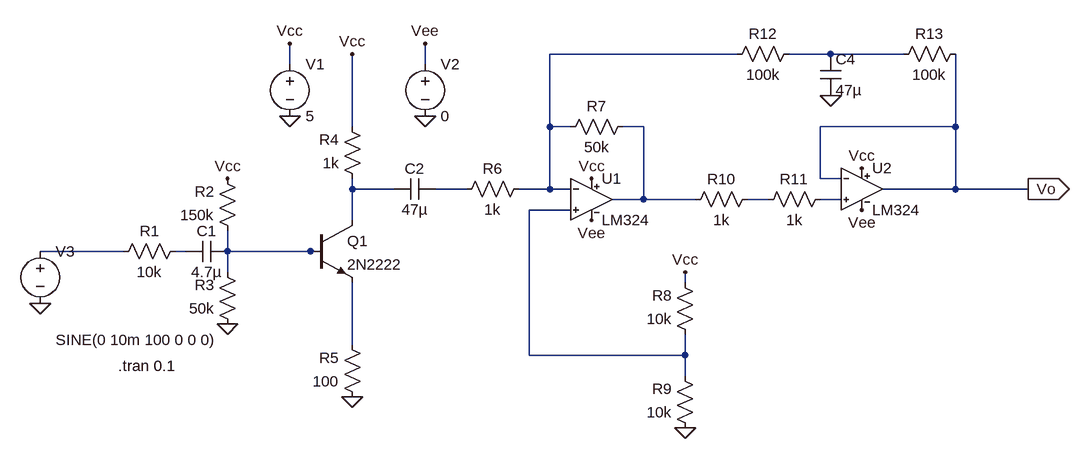
[diagram p0: schematic Draft2.asc]
Draft2.asc, the LTspice schematic file:
Version 4
SHEET 1 1352 680
WIRE 816 -176 528 -176
WIRE 960 -176 896 -176
WIRE 1072 -176 960 -176
WIRE 128 -160 128 -192
WIRE 336 -160 336 -192
WIRE 224 -64 224 -176
WIRE 528 -64 528 -176
WIRE 560 -64 528 -64
WIRE 672 -64 640 -64
WIRE 1152 -64 1152 -176
WIRE 1152 -64 944 -64
WIRE 944 16 944 -64
WIRE 976 16 944 16
WIRE 224 32 224 16
WIRE 288 32 224 32
WIRE 400 32 352 32
WIRE 528 32 528 -64
WIRE 528 32 480 32
WIRE 560 32 528 32
WIRE 1152 32 1152 -64
WIRE 1152 32 1040 32
WIRE 1264 32 1152 32
WIRE 672 48 672 -64
WIRE 672 48 624 48
WIRE 752 48 672 48
WIRE 864 48 832 48
WIRE 976 48 944 48
WIRE 560 64 496 64
WIRE 224 80 224 32
WIRE -128 128 -256 128
WIRE -32 128 -48 128
WIRE 32 128 32 96
WIRE 160 128 32 128
WIRE 176 128 160 128
WIRE 32 160 32 128
WIRE 736 176 736 160
WIRE 224 272 224 176
WIRE 496 288 496 64
WIRE 736 288 736 256
WIRE 736 288 496 288
WIRE 736 320 736 288
FLAG 128 -80 0
FLAG 336 -80 0
FLAG -256 208 0
FLAG 32 240 0
FLAG 224 352 0
FLAG 736 400 0
FLAG 128 -192 Vcc
FLAG 336 -192 Vee
FLAG 32 16 Vcc
FLAG 224 -176 Vcc
FLAG 1264 32 Vo
IOPIN 1264 32 Out
FLAG 1008 0 Vcc
FLAG 1008 64 Vee
FLAG 592 16 Vcc
FLAG 592 80 Vee
FLAG 736 160 Vcc
FLAG 960 -112 0
DATAFLAG 1216 32 ""
DATAFLAG -256 128 ""
DATAFLAG 32 128 ""
DATAFLAG 224 32 ""
DATAFLAG 528 32 ""
DATAFLAG 672 48 ""
DATAFLAG 848 48 ""
DATAFLAG 960 48 ""
DATAFLAG 1152 -64 ""
DATAFLAG 960 -176 ""
SYMBOL LM324 592 -16 R0
SYMATTR InstName U1
SYMBOL res -32 112 R90
WINDOW 0 0 56 VBottom 2
WINDOW 3 32 56 VTop 2
SYMATTR InstName R1
SYMATTR Value 10k
SYMBOL res 48 112 R180
WINDOW 0 36 76 Left 2
WINDOW 3 36 40 Left 2
SYMATTR InstName R2
SYMATTR Value 150k
SYMBOL res 48 256 R180
WINDOW 0 36 76 Left 2
WINDOW 3 36 40 Left 2
SYMATTR InstName R3
SYMATTR Value 50k
SYMBOL res 240 32 R180
WINDOW 0 36 76 Left 2
WINDOW 3 36 40 Left 2
SYMATTR InstName R4
SYMATTR Value 1k
SYMBOL res 240 368 R180
WINDOW 0 36 76 Left 2
WINDOW 3 36 40 Left 2
SYMATTR InstName R5
SYMATTR Value 100
SYMBOL npn 160 80 R0
SYMATTR InstName Q1
SYMATTR Value 2N2222
SYMBOL cap 32 112 R90
WINDOW 0 0 32 VBottom 2
WINDOW 3 32 32 VTop 2
SYMATTR InstName C1
SYMATTR Value 4.7µ
SYMBOL cap 352 16 R90
WINDOW 0 0 32 VBottom 2
WINDOW 3 32 32 VTop 2
SYMATTR InstName C2
SYMATTR Value 47µ
SYMBOL res 496 16 R90
WINDOW 0 0 56 VBottom 2
WINDOW 3 32 56 VTop 2
SYMATTR InstName R6
SYMATTR Value 1k
SYMBOL voltage 128 -176 R0
WINDOW 123 0 0 Left 0
WINDOW 39 0 0 Left 0
SYMATTR InstName V1
SYMATTR Value 5
SYMBOL voltage 336 -176 R0
WINDOW 123 0 0 Left 0
WINDOW 39 0 0 Left 0
SYMATTR InstName V2
SYMATTR Value 0
SYMBOL LM324 1008 -32 R0
SYMATTR InstName U2
SYMBOL res 656 -80 R90
WINDOW 0 0 56 VBottom 2
WINDOW 3 32 56 VTop 2
SYMATTR InstName R7
SYMATTR Value 50k
SYMBOL res 752 272 R180
WINDOW 0 36 76 Left 2
WINDOW 3 36 40 Left 2
SYMATTR InstName R8
SYMATTR Value 10k
SYMBOL res 752 416 R180
WINDOW 0 36 76 Left 2
WINDOW 3 36 40 Left 2
SYMATTR InstName R9
SYMATTR Value 10k
SYMBOL res 736 64 R270
WINDOW 0 32 56 VTop 2
WINDOW 3 0 56 VBottom 2
SYMATTR InstName R10
SYMATTR Value 1k
SYMBOL res 848 64 R270
WINDOW 0 32 56 VTop 2
WINDOW 3 0 56 VBottom 2
SYMATTR InstName R11
SYMATTR Value 1k
SYMBOL res 800 -160 R270
WINDOW 0 32 56 VTop 2
WINDOW 3 0 56 VBottom 2
SYMATTR InstName R12
SYMATTR Value 100k
SYMBOL res 1056 -160 R270
WINDOW 0 32 56 VTop 2
WINDOW 3 0 56 VBottom 2
SYMATTR InstName R13
SYMATTR Value 100k
SYMBOL voltage -256 112 R0
WINDOW 3 24 152 Left 2
WINDOW 123 24 174 Left 2
WINDOW 39 0 0 Left 0
SYMATTR Value SINE(0 10m 100 0 0 0)
SYMATTR InstName V3
SYMBOL cap 944 -176 R0
SYMATTR InstName C4
SYMATTR Value 47µ
TEXT -136 304 Left 2 !.tran 0.1

The netlist it stands for:
* Draft2.asc
XU1 N008 N001 Vcc Vee N003 LM324  ; pins In+ In- V+ V- OUT
R1 N010 N009 10k
R2 N011 Vcc 150k
R3 0 N011 50k
R4 N004 Vcc 1k
R5 0 N012 100
Q1 N004 N011 N012 0 2N2222
C1 N011 N010 4.7µ
C2 N005 N004 47µ
R6 N001 N005 1k
V1 Vcc 0 5
V2 Vee 0 0
XU2 N007 Vo Vcc Vee Vo LM324  ; pins In+ In- V+ V- OUT
R7 N003 N001 50k
R8 N008 Vcc 10k
R9 0 N008 10k
R10 N003 N006 1k
R11 N006 N007 1k
R12 N001 N002 100k
R13 N002 Vo 100k
V3 N009 0 SINE(0 10m 100 0 0 0)
C4 N002 0 47µ
.model NPN NPN
.model PNP PNP
.lib standard.bjt
.tran 0.1
.lib LM324.lib
.backanno
.end